# EAGLE design rocket_pack-basic (EAGLE 6.3)
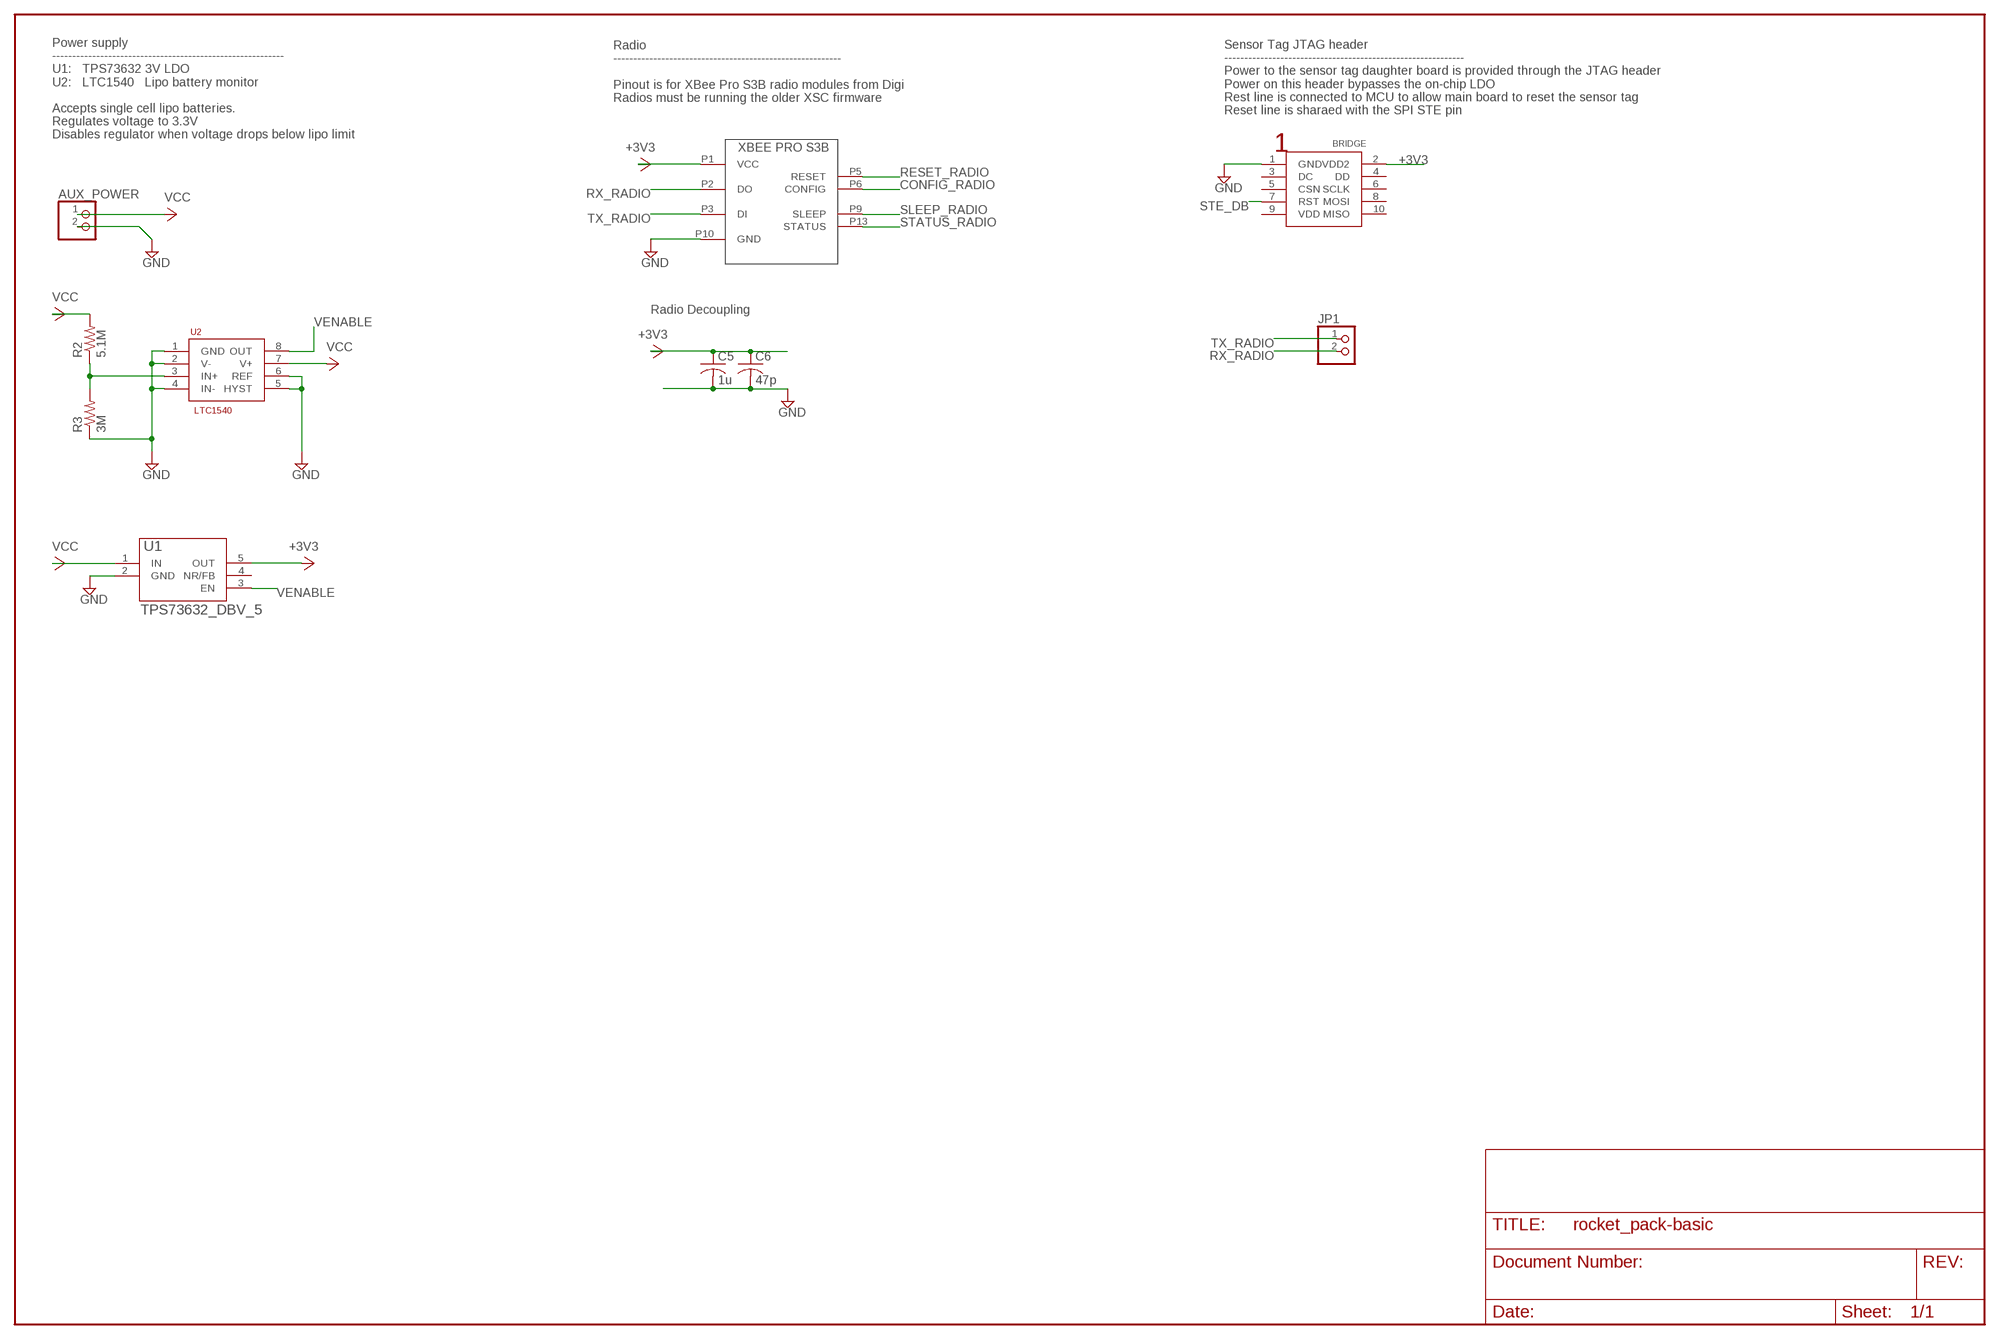
[diagram p0: schematic, sheet 1]

## Parts
AUX_POWER  PINHD-1X2  [1X02]
BRIDGE  CC-DEBUG  [2X5-1.27MM]
C5  1u  C-USC1206  [C1206]
C6  47p  C-USC1206  [C1206]
JP1  PINHD-1X2/90  [1X02/90]
R2  5.1M  R-US_R1206  [R1206]
R3  3M  R-US_R1206  [R1206]
U1  TPS73632_DBV_5  [DBV5]
U2  LTC1540  [S8]
U$1  XBEE_PRO_S3B  [PRO_S3B]

## Nets
+3V3: BRIDGE.2(VDD2) C5.1 C6.1 U1.5(OUT) U$1.P1(VCC)
CONFIG_RADIO: U$1.P6(CONFIG)
GND: AUX_POWER.2 BRIDGE.1(GND) C5.2 C6.2 R3.1 U1.2(GND) U2.1(GND) U2.2(V-) U2.4(IN-) U2.5(HYST) U2.6(REF) U$1.P10(GND)
N$1: R2.1 R3.2 U2.3(IN+)
RESET_RADIO: U$1.P5(RESET)
RX_RADIO: JP1.2 U$1.P2(DO)
SLEEP_RADIO: U$1.P9(SLEEP)
STATUS_RADIO: U$1.P13(STATUS)
STE_DB: BRIDGE.7(RST)
TX_RADIO: JP1.1 U$1.P3(DI)
VCC: AUX_POWER.1 R2.2 U1.1(IN) U2.7(V+)
VENABLE: U1.3(EN) U2.8(OUT)
Unconnected: BRIDGE.3(DC) BRIDGE.4(DD) BRIDGE.5(CSN) BRIDGE.6(SCLK) BRIDGE.8(MOSI) BRIDGE.9(VDD) BRIDGE.10(MISO) U1.4(NR/FB)

## Notes on the sheet
- Radio
  ---------------------------------------------------------
  
  Pinout is for XBee Pro S3B radio modules from Digi
  Radios must be running the older XSC firmware
- Sensor Tag JTAG header
  ------------------------------------------------------------
  Power to the sensor tag daughter board is provided through the JTAG header
  Power on this header bypasses the on-chip LDO
  Rest line is connected to MCU to allow main board to reset the sensor tag
  Reset line is sharaed with the SPI STE pin
- Power supply
  ----------------------------------------------------------
  U1:   TPS73632 3V LDO
  U2:   LTC1540   Lipo battery monitor
  
  Accepts single cell lipo batteries.  
  Regulates voltage to 3.3V
  Disables regulator when voltage drops below lipo limit
- Radio Decoupling

## Library data of the parts
AUX_POWER JP1 = pinhead:PINHD-1X2: PIN HEADER; OC_NEWARK: unknown
BRIDGE = connectors:CC-DEBUG; OC_NEWARK: unknown
C5 C6 = adafruit:C-US: CAPACITOR, American symbol; OC_NEWARK: unknown
R2 = adafruit:R-US_: RESISTOR, American symbol; MPN: MCPWR06FTEO5104; OC_NEWARK: 43T5652
R3 = adafruit:R-US_: RESISTOR, American symbol; OC_NEWARK: unknown
U1 = TexasInstruments:TPS73632_DBV_5; DATASHEETURL: http://www.ti.com/lit/gpn/TPS73632; DESCRIPTION: Single Output LDO, 400mA, Fixed(3.2V), Cap free, Low Noise, Reverse Current Protection; FAMILY_NAME: SINGLE CHANNEL LDO; GENERIC_PART_NUMBER: TPS73632; INDUSTRY_STD_PKG_TYPE: SOT-23; MANUFACTURER: Texas Instruments; MANUFACTURER_PART_NUMBER: tps73632_dbv_5; MF: TEXAS INSTRUMENT CONNECTORS; MPN: TPS73632DBVRG4; OC_NEWARK: 71J8238; PACKAGE_DESIGNATOR: DBV; PIN_COUNT: 5; VENDOR: Texas Instruments
U2 = linear:LTC1540; MPN: LTC1540CMS8#PBF; OC_NEWARK: 56M1861
U$1 = xbee:XBEE_PRO_S3B; OC_NEWARK: unknown

## Board
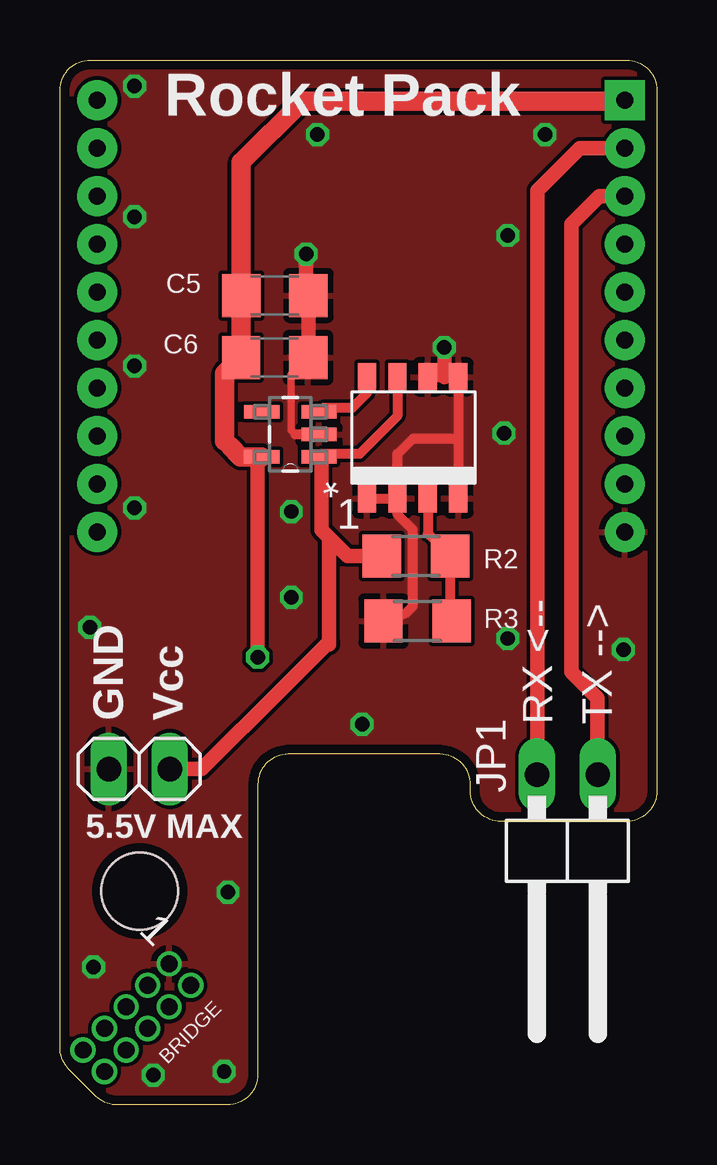
[diagram p1: board, top side]
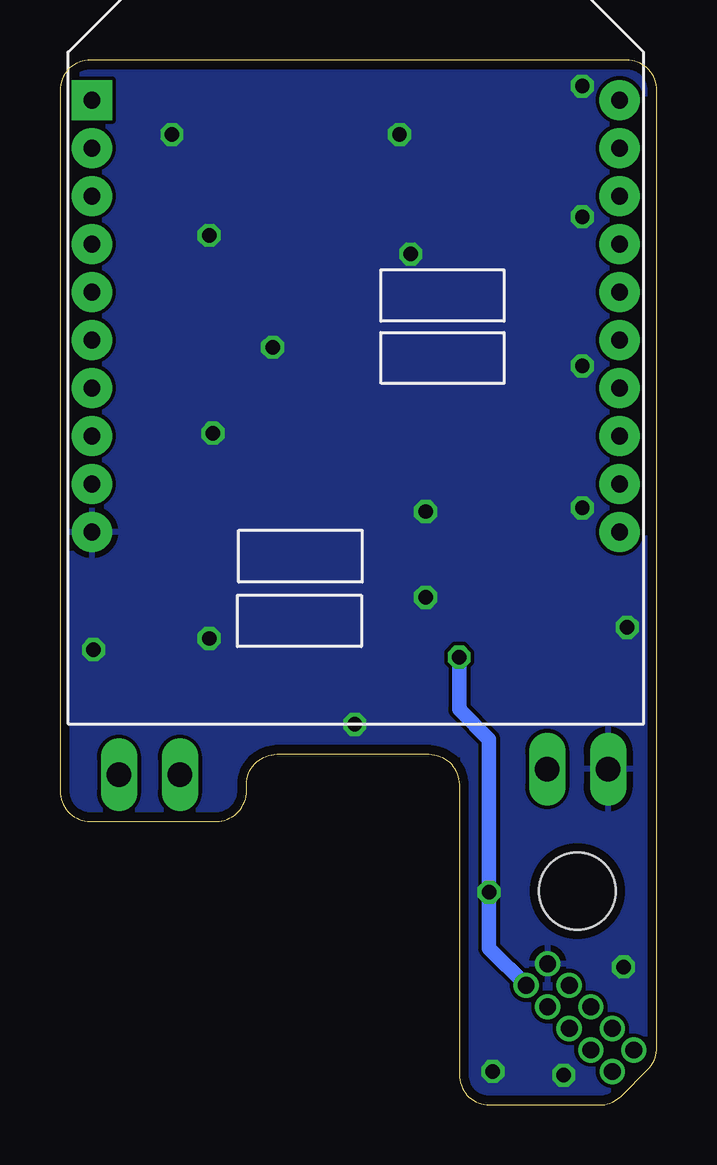
[diagram p2: board, bottom side, seen from below]

Size 24.89 x 43.56 mm. Coordinates in mm from the lower left corner, seen from the top.
Outline: 1.49,0.37 0.37,1.5 arc-45 0,2.39 0,42.29 arc-90 1.27,43.56 23.62,43.56 arc-90 24.89,42.29 24.89,13.09 arc-90 23.62,11.82 18.38,11.82 arc-90 17.11,13.09 17.11,13.35 arc90 15.84,14.62 9.52,14.62 arc90 8.25,13.35 8.25,1.27 arc-90 6.98,0 2.39,0 arc-45 1.49,0.37
Copper layers (1*16): Top 0.0356mm / dielectric 1.5011mm / Bottom 0.0356mm
Design rules "oshpark *": minimum track width 6mil, minimum drill 13mil, track to track 6mil, track to pad 6mil, pad to pad 6mil, via to via 6mil, smd to smd 6mil, copper to edge 15mil, drill to drill 6mil, minimum pad ring 7mil, minimum via ring 7mil, stop-mask expansion 4mil, vias tented up to drill 24mil, thermal gap 10mil
Holes 3.2 mm at 3.32,8.92

### Footprints (pad centres in the part's own frame; a part is rotated, then mirrored left to right if it is on the bottom)
1X02 = drill 1.016 long: 1 -1.27,0; 2 1.27,0
2X5-1.27MM = drill 0.7 pad 1.016: 1 0,0; 2 0,1.27; 3 1.27,0; 4 1.27,1.27; 5 2.54,0; 6 2.54,1.27; 7 3.81,0; 8 3.81,1.27; 9 5.08,0; 10 5.08,1.27
C1206 = smd 1.6 x 1.8: 1 -1.4,0; 2 1.4,0
1X02/90 = drill 1.016 long: 1 -1.27,-3.81; 2 1.27,-3.81
R1206 = smd 1.6 x 1.803: 1 -1.422,0; 2 1.422,0
DBV5 = smd 1.473 x 0.559: 1 -1.194,0.94; 2 -1.194,0; 3 -1.194,-0.94; 4 1.194,-0.94; 5 1.194,0.94
S8 = smd 0.762 x 1.143: 1 -2.54,-2.54; 2 -1.27,-2.54; 3 0,-2.54; 4 1.27,-2.54; 5 1.27,2.54; 6 0,2.54; 7 -1.27,2.54; 8 -2.54,2.54
PRO_S3B = drill 0.7 pad 1.676 square: P1 -11,0 | drill 0.7 pad 1.676: P2 -11,-2; P3 -11,-4; P4 -11,-6; P5 -11,-8; P6 -11,-10; P7 -11,-12; P8 -11,-14; P9 -11,-16; P10 -11,-18; P11 11,-18; P12 11,-16; P13 11,-14; P14 11,-12; P15 11,-10; P16 11,-8; P17 11,-6; P18 11,-4; P19 11,-2; P20 11,0

### Placement (x,y rotation side)
AUX_POWER  3.31,14 180 top
BRIDGE  4.55,5.88 225 top
C5  8.96,33.74 0 top
C6  8.95,31.16 0 top
JP1  21.16,9.96 180 top
R2  14.84,22.89 180 top
R3  14.91,20.18 0 top
U1  9.61,27.96 180 top
U2  15.34,27.81 0 top
U$1  12.55,41.88 0 bottom

### Tracks (layer width: path | path; a pad name or v marks a point on that pad's centre or on a via)
+3V3  (via drill 0.6)
  Top 0.61: 7.09,27.46 6.87,27.68 | U1.5 8.25,26.85 v8.25,18.67
  Top 0.813: U1.5 7.54,27.02 7.09,27.46 | 6.87,27.68 6.87,30.48 C6.1 7.55,33.73 C5.1 7.56,39.3 10.11,41.85 23.52,41.85 U$1.P1
  Bottom 0.61: BRIDGE.2 7,6.53 7,15.25 8.25,16.49 v8.25,18.67
GND  (via drill 0.6)
  Top 0.305: 9.81,27.96 9.63,28.13 9.63,30.44 C6.2
  Top 0.406: U2.6 16.02,30.35 U2.5 16.61,27.78 | 16.61,27.78 U2.4 16.64,25.24 | U2.1 U2.2 | U2.2 14.07,27.13 14.71,27.78 16.61,27.78 | R3.1 14.41,20.49 14.71,20.79 14.71,23.97 14.08,24.6 14.08,25.26 U2.2 | U1.2 9.81,27.96
  Top 0.61: C6.2 C5.2 10.27,33.84 v10.27,35.47 | v16.02,31.58 16.02,30.35
  other vias: 3.11,42.47 3.11,37.03 3.11,30.8 3.11,24.89 10.73,40.45 20.22,40.45 23.49,18.98 18.67,19.45 18.51,28 9.65,24.74 9.65,21.16 12.6,15.87 1.4,5.76 7,8.87 3.89,1.24 6.85,1.4 1.24,19.91 18.67,36.25
  pour Bottom: 0.62,43.87 24.58,43.87 24.58,11.82 17.11,11.82 17.11,14.62 8.09,14.62 8.25,0 1.87,0 -0.16,2.02 -0.16,43.09
  pour Top: 0.16,43.56 24.89,43.56 24.89,11.82 17.11,11.82 17.11,14.62 8.25,14.62 8.25,0 1.87,0 0.16,1.71
N$1
  Top 0.406: U2.3 15.34,23.82 R2.1 16.27,20.58 R3.2
RX_RADIO
  Top 0.61: U$1.P2 21.68,39.89 19.91,38.12 19.91,13.79 JP1.2
TX_RADIO
  Top 0.61: U$1.P3 22.48,37.89 21.31,36.72 21.31,18.05 22.4,16.96 22.4,13.79 JP1.1
VCC
  Top 0.406: U2.7 14.07,28.72 12.49,27.14 10.93,27.14 U1.1 10.9,26.92
  Top 0.61: R2.2 11.98,22.89 11.22,23.65 | 10.9,26.92 10.9,23.97 11.22,23.65 | 11.22,19.21 11.22,19.29 | 11.22,19.29 11.22,23.65 | 11.22,19.29 9.35,17.42 9.33,17.42 5.91,14 AUX_POWER.1
VENABLE
  Top 0.406: U2.8 12.8,29.67 12.17,29.05 10.96,29.05 U1.3

### Text on the board
_tsilk: Rocket Pack | GND | Vcc | RX <-- | TX --> | 5.5V MAX